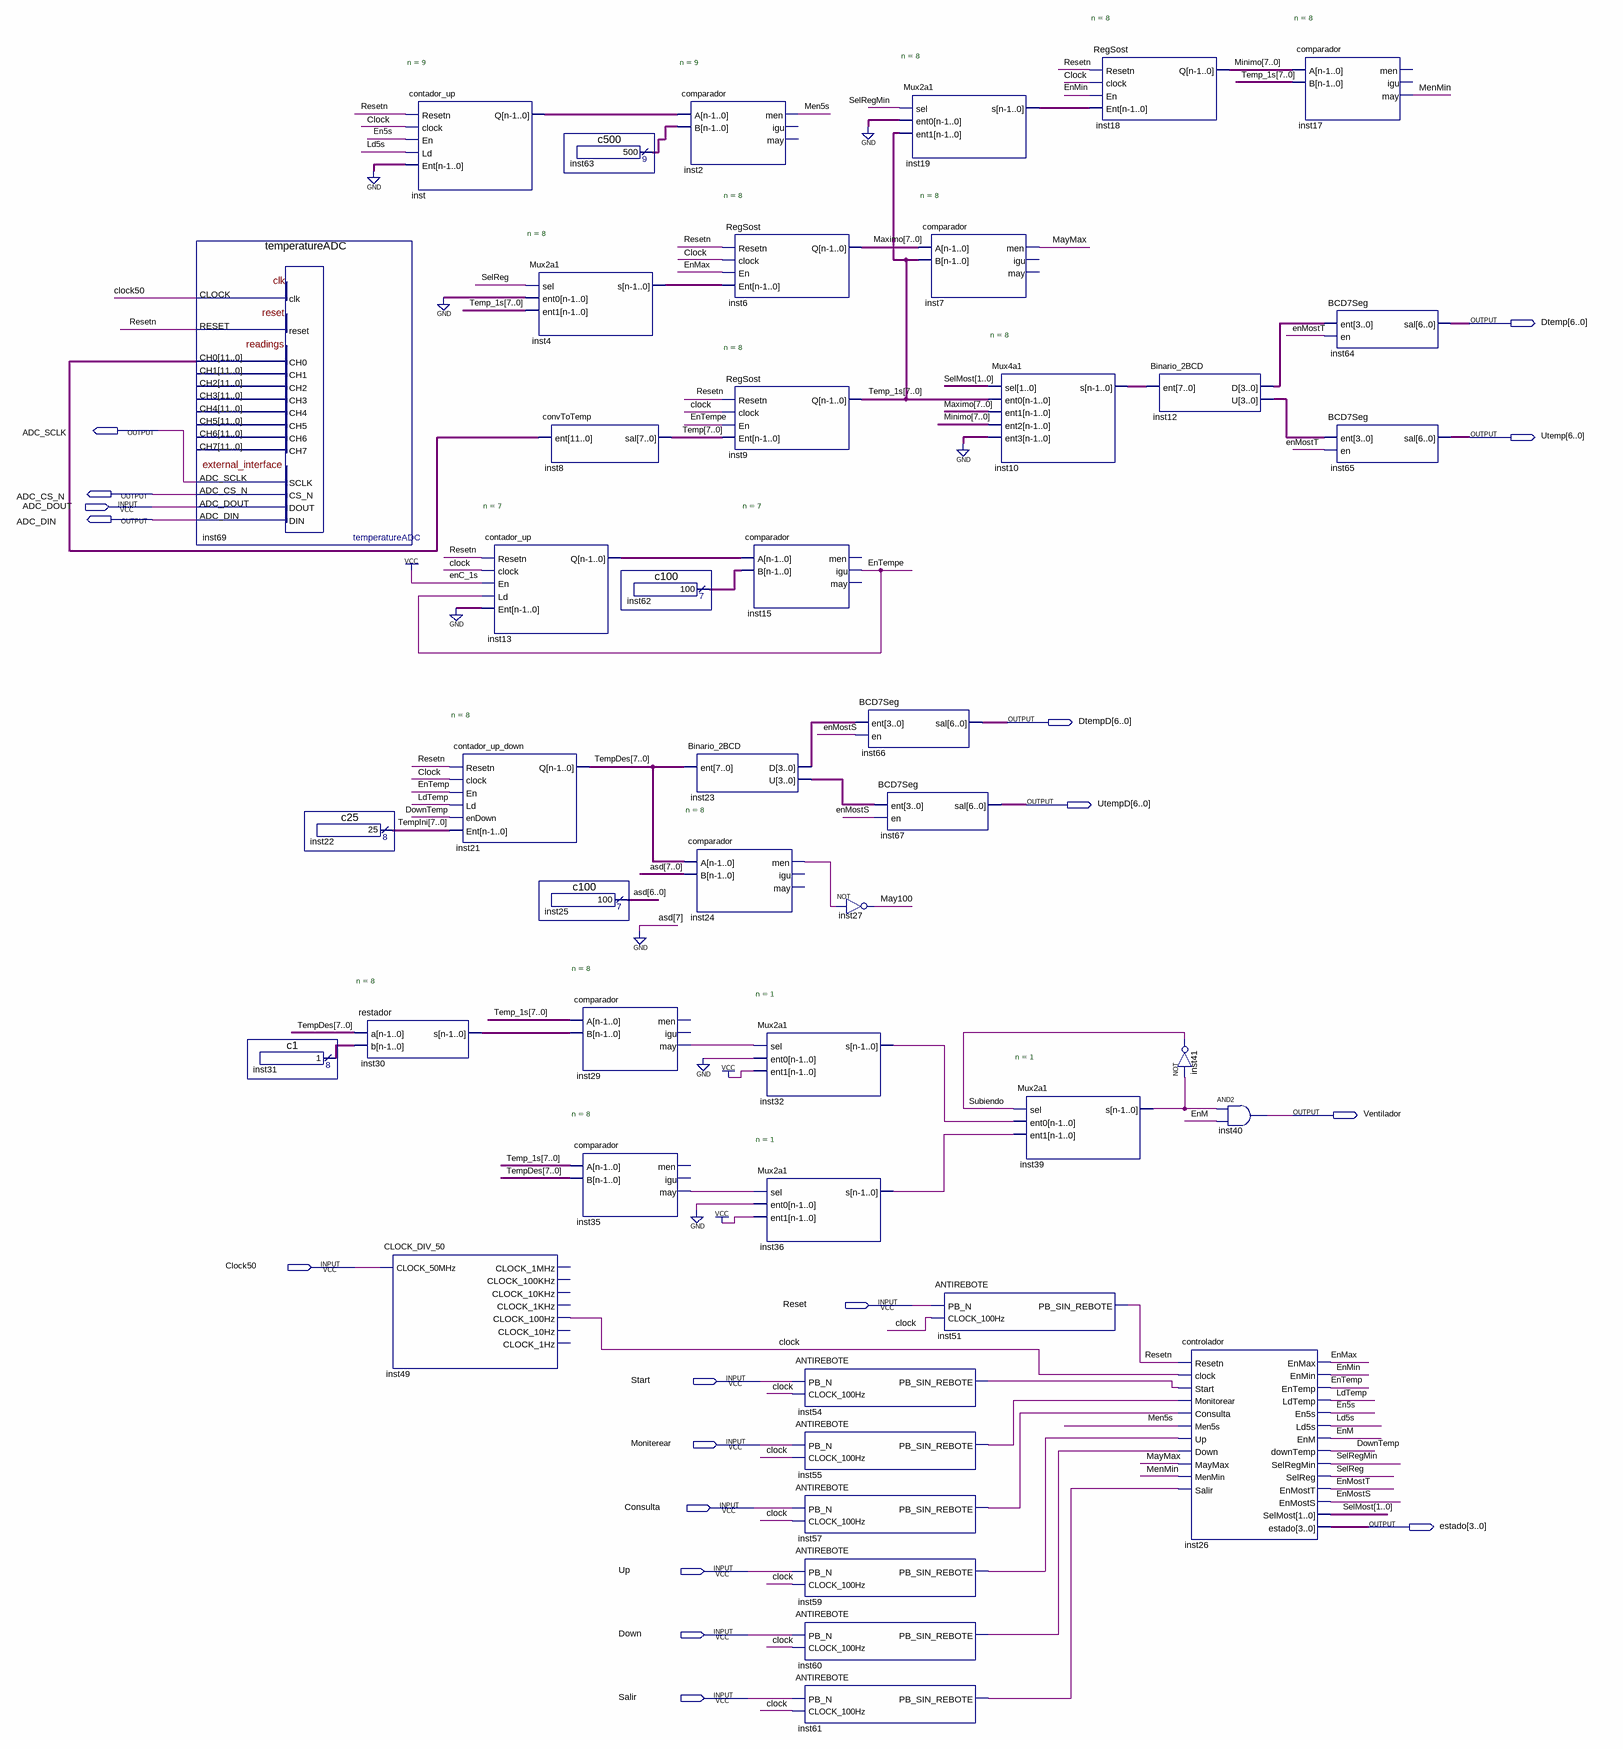
[diagram p0: schematic sheet]
// Quartus schematic temperatura.bdf as structural Verilog: 45 symbols, 18 pins
module temperatura (
  input  ADC_DOUT,
  input  Clock50,
  input  Reset,
  input  Start,
  input  Moniterear,
  input  Consulta,
  input  Up,
  input  Down,
  input  Salir,
  output [6:0] Dtemp,
  output ADC_SCLK,
  output [6:0] Utemp,
  output ADC_CS_N,
  output ADC_DIN,
  output [6:0] DtempD,
  output [6:0] UtempD,
  output Ventilador,
  output [3:0] estado
);

  wire Clock, DownTemp, En5s, EnM, EnMax, EnMin, enMostS, enMostT, EnTemp, EnTempe, inst24_men, inst29_may,
       inst32_s, inst35_may, inst36_s, inst39_s, inst54_pb_sin_rebote, inst55_pb_sin_rebote,
       inst57_pb_sin_rebote, inst59_pb_sin_rebote, inst60_pb_sin_rebote, inst61_pb_sin_rebote, Ld5s, LdTemp,
       May100, MayMax, Men5s, MenMin, Resetn, SelReg, SelRegMin, Subiendo;
  wire [1:0] SelMost;
  wire [3:0] inst12_d, inst12_u, inst23_d, inst23_u;
  wire [6:0] asd, inst13_q, inst62_result;
  wire [7:0] inst4_s, inst10_s, inst19_s, inst30_s, inst31_result, Maximo, Minimo, Temp, Temp_1s, TempDes,
       TempIni;
  wire [8:0] inst63_result, inst_q;
  wire [11:0] inst69_ch0;

  temperatureADC inst69 (
    .CLOCK(Clock50), .RESET(Resetn), .ADC_DOUT(ADC_DOUT), .CH0(inst69_ch0), .ADC_SCLK(ADC_SCLK),
    .ADC_CS_N(ADC_CS_N), .ADC_DIN(ADC_DIN));  // open: CH1, CH2, CH3, CH4, CH5, CH6, CH7
  c1 inst31 (.result(inst31_result));
  c25 inst22 (.result(TempIni));
  restador #(.n(8)) inst30 (.a(TempDes), .b(inst31_result), .s(inst30_s));
  contador_up #(.n(9)) inst (.Resetn(Resetn), .clock(Clock), .En(En5s), .Ld(Ld5s), .Ent({9{1'b0}}), .Q(inst_q));
  CLOCK_DIV_50 inst49 (
    .CLOCK_50MHz(Clock50), .CLOCK_100Hz(Clock));  // open: CLOCK_1MHz, CLOCK_100KHz, CLOCK_10KHz, CLOCK_1KHz, CLOCK_10Hz, CLOCK_1Hz
  contador_up_down #(.n(8)) inst21 (
    .Resetn(Resetn), .clock(Clock), .En(EnTemp), .Ld(LdTemp), .enDown(DownTemp), .Ent(TempIni), .Q(TempDes));
  contador_up #(.n(7)) inst13 (.Resetn(Resetn), .clock(Clock), .En(1'b1), .Ld(EnTempe), .Ent({7{1'b0}}), .Q(inst13_q));
  Mux2a1 #(.n(8)) inst4 (.sel(SelReg), .ent0({8{1'b0}}), .ent1(Temp_1s), .s(inst4_s));
  convToTemp inst8 (.ent(inst69_ch0), .sal(Temp));
  c100 inst25 (.result(asd));
  c500 inst63 (.result(inst63_result));
  comparador #(.n(8)) inst29 (.A(Temp_1s), .B(inst30_s), .may(inst29_may));  // open: men, igu
  comparador #(.n(8)) inst35 (.A(Temp_1s), .B(TempDes), .may(inst35_may));  // open: men, igu
  c100 inst62 (.result(inst62_result));
  comparador #(.n(9)) inst2 (.A(inst_q), .B(inst63_result), .men(Men5s));  // open: igu, may
  Binario_2BCD inst23 (.ent(TempDes), .D(inst23_d), .U(inst23_u));
  comparador #(.n(8)) inst24 (.A(TempDes), .B({1'b0, asd}), .men(inst24_men));  // open: igu, may
  RegSost #(.n(8)) inst6 (.Resetn(Resetn), .clock(Clock), .En(EnMax), .Ent(inst4_s), .Q(Maximo));
  RegSost #(.n(8)) inst9 (.Resetn(Resetn), .clock(Clock), .En(EnTempe), .Ent(Temp), .Q(Temp_1s));
  comparador #(.n(7)) inst15 (.A(inst13_q), .B(inst62_result), .igu(EnTempe));  // open: men, may
  Mux2a1 #(.n(1)) inst32 (.sel(inst29_may), .ent0(1'b0), .ent1(1'b1), .s(inst32_s));
  Mux2a1 #(.n(1)) inst36 (.sel(inst35_may), .ent0(1'b0), .ent1(1'b1), .s(inst36_s));
  ANTIREBOTE inst54 (.PB_N(Start), .CLOCK_100Hz(Clock), .PB_SIN_REBOTE(inst54_pb_sin_rebote));
  ANTIREBOTE inst55 (.PB_N(Moniterear), .CLOCK_100Hz(Clock), .PB_SIN_REBOTE(inst55_pb_sin_rebote));
  ANTIREBOTE inst57 (.PB_N(Consulta), .CLOCK_100Hz(Clock), .PB_SIN_REBOTE(inst57_pb_sin_rebote));
  ANTIREBOTE inst59 (.PB_N(Up), .CLOCK_100Hz(Clock), .PB_SIN_REBOTE(inst59_pb_sin_rebote));
  ANTIREBOTE inst60 (.PB_N(Down), .CLOCK_100Hz(Clock), .PB_SIN_REBOTE(inst60_pb_sin_rebote));
  ANTIREBOTE inst61 (.PB_N(Salir), .CLOCK_100Hz(Clock), .PB_SIN_REBOTE(inst61_pb_sin_rebote));
  BCD7Seg inst66 (.ent(inst23_d), .en(enMostS), .sal(DtempD));
  not inst27 (May100, inst24_men);
  Mux2a1 #(.n(8)) inst19 (.sel(SelRegMin), .ent0({8{1'b0}}), .ent1(Temp_1s), .s(inst19_s));
  BCD7Seg inst67 (.ent(inst23_u), .en(enMostS), .sal(UtempD));
  comparador #(.n(8)) inst7 (.A(Maximo), .B(Temp_1s), .men(MayMax));  // open: igu, may
  ANTIREBOTE inst51 (.PB_N(Reset), .CLOCK_100Hz(Clock), .PB_SIN_REBOTE(Resetn));
  Mux4a1 #(.n(8)) inst10 (.sel(SelMost), .ent0(Temp_1s), .ent1(Maximo), .ent2(Minimo), .ent3({8{1'b0}}), .s(inst10_s));
  Mux2a1 #(.n(1)) inst39 (.sel(Subiendo), .ent0(inst32_s), .ent1(inst36_s), .s(inst39_s));
  RegSost #(.n(8)) inst18 (.Resetn(Resetn), .clock(Clock), .En(EnMin), .Ent(inst19_s), .Q(Minimo));
  Binario_2BCD inst12 (.ent(inst10_s), .D(inst12_d), .U(inst12_u));
  not inst41 (Subiendo, inst39_s);
  and inst40 (Ventilador, inst39_s, EnM);
  controlador inst26 (
    .Resetn(Resetn), .clock(Clock), .Start(inst54_pb_sin_rebote), .Monitorear(inst55_pb_sin_rebote),
    .Consulta(inst57_pb_sin_rebote), .Men5s(Men5s), .Up(inst59_pb_sin_rebote), .Down(inst60_pb_sin_rebote),
    .MayMax(MayMax), .MenMin(MenMin), .Salir(inst61_pb_sin_rebote), .EnMax(EnMax), .EnMin(EnMin),
    .EnTemp(EnTemp), .LdTemp(LdTemp), .En5s(En5s), .Ld5s(Ld5s), .EnM(EnM), .downTemp(DownTemp),
    .SelRegMin(SelRegMin), .SelReg(SelReg), .EnMostT(enMostT), .EnMostS(enMostS), .SelMost(SelMost),
    .estado(estado));
  comparador #(.n(8)) inst17 (.A(Minimo), .B(Temp_1s), .may(MenMin));  // open: men, igu
  BCD7Seg inst64 (.ent(inst12_d), .en(enMostT), .sal(Dtemp));
  BCD7Seg inst65 (.ent(inst12_u), .en(enMostT), .sal(Utemp));
endmodule
